# Altium schematic sheet HC-05_BlueTooth.SchDoc
size A; SheetNumber: 7; SheetTotal: 12
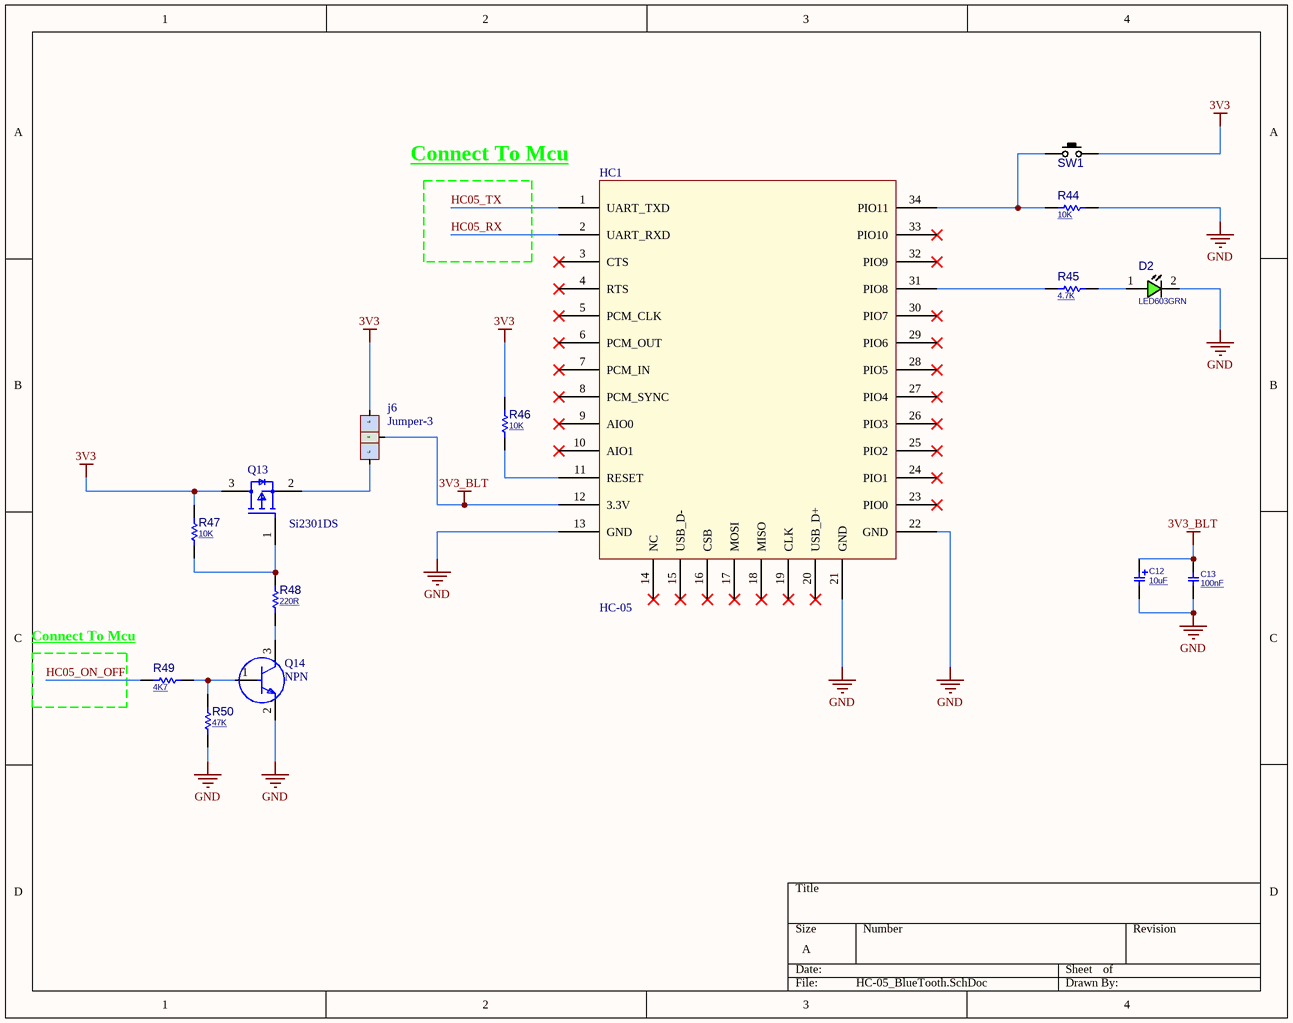
[diagram p0: HC-05_BlueTooth.SchDoc]

## Parts
C12  value 10uF  [C_TN_3216]  (hidden comment: 4.7uF)
C13  100nF  [C0603]
D2  LED603GRN  [LED0603GRN]
HC1  HC-05  [HC-05]
j6  Jumper-3  [jumper-3]
Q13  Si2301DS  [FP-S-03946-IPC_A]
Q14  NPN  [FP-SOT23-IPC_A]
R44  10K  [R0603]
R45  4.7K  [R0603]
R46  10K  [R0603]
R47  10K  [R0603]
R48  220R  [R0603]
R49  4K7  [R0603]
R50  47K  [R0603]
SW1  PUSHBUTTON  [SWPBS_SPST_6X3X5]  (value not drawn)

## Nets
3V3: j6.1 Q13.3(D) R46.1 R47.2 SW1.2(P3)
3V3_BLT: C12.1 C13.2 HC1.12(3.3V) j6.2
GND: C12.2 C13.1 D2.2(CATHODE) HC1.13(GND) HC1.21(GND) HC1.22(GND) Q14.2(E) R44.1 R50.1
HC05_ON_OFF: R49.1
HC05_RX: HC1.2(UART_RXD)
HC05_TX: HC1.1(UART_TXD)
NetD2_1: D2.1(ANODE) R45.1
NetHC1_11: HC1.11(RESET) R46.2
NetHC1_31: HC1.31(PIO8) R45.2
NetHC1_34: HC1.34(PIO11) R44.2 SW1.1(P1)
Netj6_3: j6.3 Q13.2(S)
NetQ13_1: Q13.1(G) R47.1 R48.2
NetQ14_1: Q14.1(B) R49.2 R50.2
NetQ14_3: Q14.3(C) R48.1

Not connected (* = marked no-connect by the designer): HC1 3(CTS)* 4(RTS)* 5(PCM_CLK)* 6(PCM_OUT)* 7(PCM_IN)* 8(PCM_SYNC)* 9(AIO0)* 10(AIO1)* 14(NC)* 15(USB_D-)* 16(CSB)* 17(MOSI)* 18(MISO)* 19(CLK)* 20(USB_D+)* 23(PIO0)* 24(PIO1)* 25(PIO2)* 26(PIO3)* 27(PIO4)* 28(PIO5)* 29(PIO6)* 30(PIO7)* 32(PIO9)* 33(PIO10)*

## Notes on the sheet
- Connect To Mcu
- (near R49) Connect To Mcu
- (in symbol Jumper-3) A; B; C

## Library data of the parts
C12 = CAP_SMD_TAN_3216: CAP, SMD, TAN,; PARAM2: -V
C13 = CAP_SMD_MLCC_0603: CAP, MLCC, -F, -V, MATERIAL, -%, 0201; PARAM: -, -%; MANF_P#: MANF_PART#; PRICE: 100= 1$; MANF: -; PARAM2: -V; ASSEMBLY: ASSEMBLY; VALUE: 100nF
D2 = LED_SMD_0603_GRN: LED, SMD, 0603, GREEN; PARAM: 20mA; MANF: Kingbright; DESC: DESCRIPTION; MANF_P#: APT1608SGC; PARAM2: 2.2V; ASSEMBLY: ASSEMBLY; PRICE: 1: 0.14$, 100: 6.8$; VALUE: LED603GRN
HC1 = HC-05: HC serial Bluetooth products consist of Bluetooth serial interface module and Bluetooth adapter, such; ComponentLink1Description: Website: Tarahiboard; ComponentLink1URL: https://www.tarahiboard.com/; ComponentLink2Description: Telegram; ComponentLink2URL: https://t.me/tarahiboard; ComponentLink3Description: Instagram; ComponentLink3URL: https://instagram.com/tarahiboard; DatasheetVersion: 2022
Q13 = Si2301DS: P-Channel 1.25-W, 2.5-V MOSFET; Manufacturer: Vishay; Manufacturer Part Number: SI2303CDS-T1-GE3; Max Forward Diode Voltage: -1.2V; Pulse Drain Current: -10A; Standoff Height: 0.01mm; Rthja Max: 120°C/W; Depletion Mode: False; Max Junction Temp: +150°C; Gate Charge At Vgs: 4nC @ -10V; Gate To Source Voltage: 20V; Drain To Source Voltage: -30V; Continuous Drain Current: -1.9A; Drain To Source Resistance: 0.158Ω; Reverse Recovery Charge: 9nC; Reverse Recovery Time: 17ns; Number Of Channels: 1; Typ Forward Diode Voltage: -0.8V; Power Dissipation: 1W; Turn Off Delay Time: 11ns; Input Capacitace At Vds: 155pF @ -15V; Transconductance: 2S; Turn On Delay Time: 4ns; Threshold Vgs Max: -3V; Threshold Vgs Min: -1V; Height: 1.12mm; Automotive: No; Device Class L1: Discrete Semiconductors; Digikey Description: MOSFET P-CH 30V 2.7A SOT23-3; Temperature Range Low: -55°C; Device Class L3: MOSFETs; Mouser Description: MOSFET 30V 2.7A 2.3W 190 mohms @ 10V; Octopart: https://octopart.com/si2303cds-t1-ge3-vishay-43171446; Drain To Source Breakdown Voltage: -30V; Device Class L2: Transistors; Package: S-03946; ComponentLink2Description: Datasheet; Ipc Land Pattern Name: SOT95P237X100-3; ComponentLink2URL: http://www.vishay.com/docs/69991/si2303cd.pdf; Number Of P Channels: 1; Temperature Range High: +150°C; Category: Trans; Lead Free: Yes; RoHS: TRUE; Temperature: -55°C to +150°C
Q14 = CMP-2000-04931-2: Frequency: 300MHz; Collector Emitter Voltage (VCEO): 40V; Power Dissipation: 350mW; Element Configuration: Single; Max Power Dissipation: 300mW; Max Collector Current: 200mA; Collector Emitter Saturation Voltage: 300mV; Number of Elements: 1; hFE Min: 100; Collector Base Voltage (VCBO): 60V; Emitter Base Voltage (VEBO): 6V; Contact Plating: Tin; Package Quantity: 3000; Max Frequency: 300MHz; REACH SVHC: No SVHC; Max Operating Temperature: 150°C; Width: 1.4mm; Voltage Rating (DC): 40V; Radiation Hardening: No; Case/Package: SOT-23; Height: 1mm; Collector Emitter Breakdown Voltage: 40V; Length: 3.05mm; Polarity: NPN; Packaging: Tape and Reel; Number of Pins: 3; Min Operating Temperature: -55°C; Gain Bandwidth Product: 300MHz; Mount: Surface Mount; Weight: 0.000282oz; Continuous Collector Current: 200mA; Transition Frequency: 300MHz; Max Breakdown Voltage: 40V; Lead Free: Lead Free
R44-R50 = RES_SMD: RESISTOR, SMD; PARAM: -W; DESC: DESCRIPTION; DIST#: MOUSER; PARAM2: 1%; MANF_P#: -; MANF: -; ASSEMBLY: ASSEMBLY; PRICE: 100= 0.5$
  R44 R46 R47: VALUE: 10K
  R45: VALUE: 4.7K
  R48: VALUE: 220R
  R49: VALUE: 4K7
  R50: VALUE: 47K
SW1 = SWPBS_SPST_6X3X5: SWITCH, PUSH BUTTON, TACTILE, SMD, SPST, 6X3.5X5mm; MANF: ALPS; DESC: DESCRIPTION; MANF_P#: SKQMBBE010; VALUE: PUSHBUTTON; ASSEMBLY: ASSEMBLY; PARAM: PARAM; PRICE: PRICE